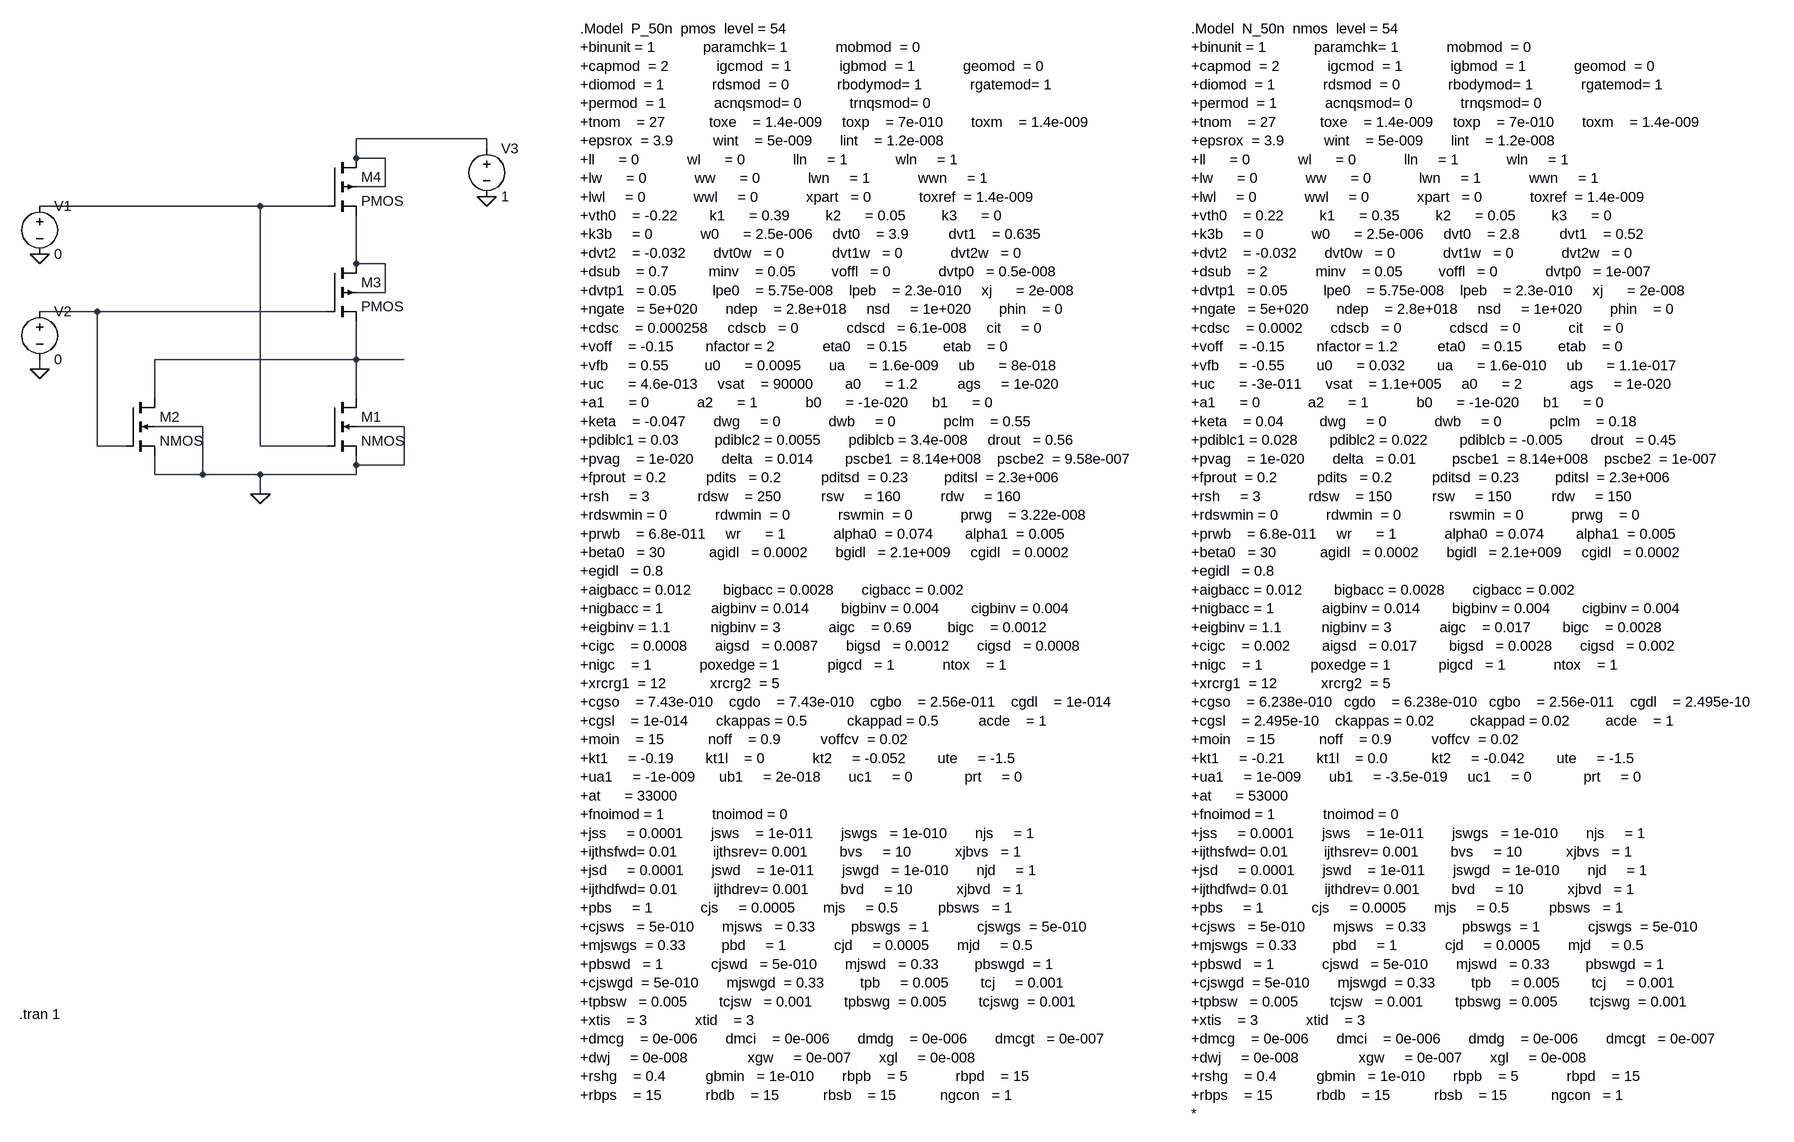
[diagram p0: schematic Draft2.asc]
Draft2.asc, the LTspice schematic file:
Version 4
SHEET 1 3248 1172
WIRE 336 -304 112 -304
WIRE 336 -288 336 -304
WIRE 112 -272 112 -304
WIRE 160 -272 112 -272
WIRE 160 -224 160 -272
WIRE 160 -224 112 -224
WIRE -48 -192 -416 -192
WIRE 64 -192 -48 -192
WIRE 112 -96 112 -176
WIRE 160 -96 112 -96
WIRE 160 -48 160 -96
WIRE 160 -48 112 -48
WIRE -320 -16 -416 -16
WIRE 64 -16 -320 -16
WIRE 112 64 112 0
WIRE 112 64 -224 64
WIRE 192 64 112 64
WIRE -416 80 -416 64
WIRE -224 128 -224 64
WIRE 112 128 112 64
WIRE -144 176 -224 176
WIRE 192 176 112 176
WIRE -320 208 -320 -16
WIRE -272 208 -320 208
WIRE -48 208 -48 -192
WIRE 64 208 -48 208
WIRE 112 240 112 224
WIRE 192 240 192 176
WIRE 192 240 112 240
WIRE -224 256 -224 224
WIRE -144 256 -144 176
WIRE -144 256 -224 256
WIRE -48 256 -144 256
WIRE 112 256 112 240
WIRE 112 256 -48 256
WIRE -48 288 -48 256
FLAG -48 288 0
FLAG -416 -112 0
FLAG -416 80 0
FLAG 336 -208 0
SYMBOL nmos4 64 128 R0
SYMATTR InstName M1
SYMBOL nmos4 -272 128 R0
SYMATTR InstName M2
SYMBOL pmos4 64 -96 R0
SYMATTR InstName M3
SYMBOL pmos4 64 -272 R0
SYMATTR InstName M4
SYMBOL voltage -416 -208 R0
WINDOW 123 0 0 Left 0
WINDOW 39 0 0 Left 0
SYMATTR InstName V1
SYMATTR Value 0
SYMBOL voltage -416 -32 R0
WINDOW 123 0 0 Left 0
WINDOW 39 0 0 Left 0
SYMATTR InstName V2
SYMATTR Value 0
SYMBOL voltage 336 -304 R0
WINDOW 123 0 0 Left 0
WINDOW 39 0 0 Left 0
SYMATTR InstName V3
SYMATTR Value 1
TEXT 968 -488 Left 2 !.Model  P_50n  pmos  level = 54\n+binunit = 1            paramchk= 1            mobmod  = 0          \n+capmod  = 2            igcmod  = 1            igbmod  = 1            geomod  = 0          \n+diomod  = 1            rdsmod  = 0            rbodymod= 1            rgatemod= 1          \n+permod  = 1            acnqsmod= 0            trnqsmod= 0          \n+tnom    = 27           toxe    = 1.4e-009     toxp    = 7e-010       toxm    = 1.4e-009   \n+epsrox  = 3.9          wint    = 5e-009       lint    = 1.2e-008   \n+ll      = 0            wl      = 0            lln     = 1            wln     = 1          \n+lw      = 0            ww      = 0            lwn     = 1            wwn     = 1          \n+lwl     = 0            wwl     = 0            xpart   = 0            toxref  = 1.4e-009   \n+vth0    = -0.22        k1      = 0.39         k2      = 0.05         k3      = 0          \n+k3b     = 0            w0      = 2.5e-006     dvt0    = 3.9          dvt1    = 0.635        \n+dvt2    = -0.032       dvt0w   = 0            dvt1w   = 0            dvt2w   = 0          \n+dsub    = 0.7          minv    = 0.05         voffl   = 0            dvtp0   = 0.5e-008     \n+dvtp1   = 0.05         lpe0    = 5.75e-008    lpeb    = 2.3e-010     xj      = 2e-008     \n+ngate   = 5e+020       ndep    = 2.8e+018     nsd     = 1e+020       phin    = 0          \n+cdsc    = 0.000258     cdscb   = 0            cdscd   = 6.1e-008     cit     = 0          \n+voff    = -0.15        nfactor = 2            eta0    = 0.15         etab    = 0          \n+vfb     = 0.55         u0      = 0.0095       ua      = 1.6e-009     ub      = 8e-018     \n+uc      = 4.6e-013     vsat    = 90000        a0      = 1.2          ags     = 1e-020     \n+a1      = 0            a2      = 1            b0      = -1e-020      b1      = 0          \n+keta    = -0.047       dwg     = 0            dwb     = 0            pclm    = 0.55       \n+pdiblc1 = 0.03         pdiblc2 = 0.0055       pdiblcb = 3.4e-008     drout   = 0.56       \n+pvag    = 1e-020       delta   = 0.014        pscbe1  = 8.14e+008    pscbe2  = 9.58e-007  \n+fprout  = 0.2          pdits   = 0.2          pditsd  = 0.23         pditsl  = 2.3e+006   \n+rsh     = 3            rdsw    = 250          rsw     = 160          rdw     = 160        \n+rdswmin = 0            rdwmin  = 0            rswmin  = 0            prwg    = 3.22e-008  \n+prwb    = 6.8e-011     wr      = 1            alpha0  = 0.074        alpha1  = 0.005      \n+beta0   = 30           agidl   = 0.0002       bgidl   = 2.1e+009     cgidl   = 0.0002     \n+egidl   = 0.8          \n+aigbacc = 0.012        bigbacc = 0.0028       cigbacc = 0.002\n+nigbacc = 1            aigbinv = 0.014        bigbinv = 0.004        cigbinv = 0.004\n+eigbinv = 1.1          nigbinv = 3            aigc    = 0.69         bigc    = 0.0012\n+cigc    = 0.0008       aigsd   = 0.0087       bigsd   = 0.0012       cigsd   = 0.0008\n+nigc    = 1            poxedge = 1            pigcd   = 1            ntox    = 1\n+xrcrg1  = 12           xrcrg2  = 5          \n+cgso    = 7.43e-010    cgdo    = 7.43e-010    cgbo    = 2.56e-011    cgdl    = 1e-014     \n+cgsl    = 1e-014       ckappas = 0.5          ckappad = 0.5          acde    = 1          \n+moin    = 15           noff    = 0.9          voffcv  = 0.02       \n+kt1     = -0.19        kt1l    = 0            kt2     = -0.052        ute     = -1.5\n+ua1     = -1e-009      ub1     = 2e-018       uc1     = 0             prt     = 0\n+at      = 33000\n+fnoimod = 1            tnoimod = 0          \n+jss     = 0.0001       jsws    = 1e-011       jswgs   = 1e-010       njs     = 1          \n+ijthsfwd= 0.01         ijthsrev= 0.001        bvs     = 10           xjbvs   = 1          \n+jsd     = 0.0001       jswd    = 1e-011       jswgd   = 1e-010       njd     = 1          \n+ijthdfwd= 0.01         ijthdrev= 0.001        bvd     = 10           xjbvd   = 1          \n+pbs     = 1            cjs     = 0.0005       mjs     = 0.5          pbsws   = 1          \n+cjsws   = 5e-010       mjsws   = 0.33         pbswgs  = 1            cjswgs  = 5e-010     \n+mjswgs  = 0.33         pbd     = 1            cjd     = 0.0005       mjd     = 0.5        \n+pbswd   = 1            cjswd   = 5e-010       mjswd   = 0.33         pbswgd  = 1          \n+cjswgd  = 5e-010       mjswgd  = 0.33         tpb     = 0.005        tcj     = 0.001      \n+tpbsw   = 0.005        tcjsw   = 0.001        tpbswg  = 0.005        tcjswg  = 0.001      \n+xtis    = 3            xtid    = 3          \n+dmcg    = 0e-006       dmci    = 0e-006       dmdg    = 0e-006       dmcgt   = 0e-007     \n+dwj     = 0e-008               xgw     = 0e-007       xgl     = 0e-008     \n+rshg    = 0.4          gbmin   = 1e-010       rbpb    = 5            rbpd    = 15         \n+rbps    = 15           rbdb    = 15           rbsb    = 15           ngcon   = 1
TEXT 2192 -488 Left 2 !.Model  N_50n  nmos  level = 54\n+binunit = 1            paramchk= 1            mobmod  = 0          \n+capmod  = 2            igcmod  = 1            igbmod  = 1            geomod  = 0          \n+diomod  = 1            rdsmod  = 0            rbodymod= 1            rgatemod= 1          \n+permod  = 1            acnqsmod= 0            trnqsmod= 0          \n+tnom    = 27           toxe    = 1.4e-009     toxp    = 7e-010       toxm    = 1.4e-009   \n+epsrox  = 3.9          wint    = 5e-009       lint    = 1.2e-008   \n+ll      = 0            wl      = 0            lln     = 1            wln     = 1          \n+lw      = 0            ww      = 0            lwn     = 1            wwn     = 1          \n+lwl     = 0            wwl     = 0            xpart   = 0            toxref  = 1.4e-009   \n+vth0    = 0.22         k1      = 0.35         k2      = 0.05         k3      = 0          \n+k3b     = 0            w0      = 2.5e-006     dvt0    = 2.8          dvt1    = 0.52       \n+dvt2    = -0.032       dvt0w   = 0            dvt1w   = 0            dvt2w   = 0          \n+dsub    = 2            minv    = 0.05         voffl   = 0            dvtp0   = 1e-007     \n+dvtp1   = 0.05         lpe0    = 5.75e-008    lpeb    = 2.3e-010     xj      = 2e-008     \n+ngate   = 5e+020       ndep    = 2.8e+018     nsd     = 1e+020       phin    = 0          \n+cdsc    = 0.0002       cdscb   = 0            cdscd   = 0            cit     = 0          \n+voff    = -0.15        nfactor = 1.2          eta0    = 0.15         etab    = 0          \n+vfb     = -0.55        u0      = 0.032        ua      = 1.6e-010     ub      = 1.1e-017   \n+uc      = -3e-011      vsat    = 1.1e+005     a0      = 2            ags     = 1e-020     \n+a1      = 0            a2      = 1            b0      = -1e-020      b1      = 0          \n+keta    = 0.04         dwg     = 0            dwb     = 0            pclm    = 0.18       \n+pdiblc1 = 0.028        pdiblc2 = 0.022        pdiblcb = -0.005       drout   = 0.45       \n+pvag    = 1e-020       delta   = 0.01         pscbe1  = 8.14e+008    pscbe2  = 1e-007     \n+fprout  = 0.2          pdits   = 0.2          pditsd  = 0.23         pditsl  = 2.3e+006   \n+rsh     = 3            rdsw    = 150          rsw     = 150          rdw     = 150        \n+rdswmin = 0            rdwmin  = 0            rswmin  = 0            prwg    = 0          \n+prwb    = 6.8e-011     wr      = 1            alpha0  = 0.074        alpha1  = 0.005      \n+beta0   = 30           agidl   = 0.0002       bgidl   = 2.1e+009     cgidl   = 0.0002     \n+egidl   = 0.8          \n+aigbacc = 0.012        bigbacc = 0.0028       cigbacc = 0.002\n+nigbacc = 1            aigbinv = 0.014        bigbinv = 0.004        cigbinv = 0.004\n+eigbinv = 1.1          nigbinv = 3            aigc    = 0.017        bigc    = 0.0028\n+cigc    = 0.002        aigsd   = 0.017        bigsd   = 0.0028       cigsd   = 0.002\n+nigc    = 1            poxedge = 1            pigcd   = 1            ntox    = 1\n+xrcrg1  = 12           xrcrg2  = 5          \n+cgso    = 6.238e-010   cgdo    = 6.238e-010   cgbo    = 2.56e-011    cgdl    = 2.495e-10     \n+cgsl    = 2.495e-10    ckappas = 0.02         ckappad = 0.02         acde    = 1          \n+moin    = 15           noff    = 0.9          voffcv  = 0.02       \n+kt1     = -0.21        kt1l    = 0.0           kt2     = -0.042        ute     = -1.5\n+ua1     = 1e-009       ub1     = -3.5e-019     uc1     = 0             prt     = 0\n+at      = 53000\n+fnoimod = 1            tnoimod = 0          \n+jss     = 0.0001       jsws    = 1e-011       jswgs   = 1e-010       njs     = 1          \n+ijthsfwd= 0.01         ijthsrev= 0.001        bvs     = 10           xjbvs   = 1          \n+jsd     = 0.0001       jswd    = 1e-011       jswgd   = 1e-010       njd     = 1          \n+ijthdfwd= 0.01         ijthdrev= 0.001        bvd     = 10           xjbvd   = 1          \n+pbs     = 1            cjs     = 0.0005       mjs     = 0.5          pbsws   = 1          \n+cjsws   = 5e-010       mjsws   = 0.33         pbswgs  = 1            cjswgs  = 5e-010     \n+mjswgs  = 0.33         pbd     = 1            cjd     = 0.0005       mjd     = 0.5        \n+pbswd   = 1            cjswd   = 5e-010       mjswd   = 0.33         pbswgd  = 1          \n+cjswgd  = 5e-010       mjswgd  = 0.33         tpb     = 0.005        tcj     = 0.001      \n+tpbsw   = 0.005        tcjsw   = 0.001        tpbswg  = 0.005        tcjswg  = 0.001      \n+xtis    = 3            xtid    = 3          \n+dmcg    = 0e-006       dmci    = 0e-006       dmdg    = 0e-006       dmcgt   = 0e-007     \n+dwj     = 0e-008               xgw     = 0e-007       xgl     = 0e-008     \n+rshg    = 0.4          gbmin   = 1e-010       rbpb    = 5            rbpd    = 15         \n+rbps    = 15           rbdb    = 15           rbsb    = 15           ngcon   = 1\n*
TEXT -450 1156 Left 2 !.tran 1

The netlist it stands for:
* Draft2.asc
M1 N005 N002 0 0 NMOS
M2 N005 N004 0 0 NMOS
M3 N003 N004 N005 N003 PMOS
M4 N001 N002 N003 N001 PMOS
V1 N002 0 0
V2 N004 0 0
V3 N001 0 1
.model NMOS NMOS
.model PMOS PMOS
.lib standard.mos
.Model  P_50n  pmos  level = 54
+binunit = 1            paramchk= 1            mobmod  = 0
+capmod  = 2            igcmod  = 1            igbmod  = 1            geomod  = 0
+diomod  = 1            rdsmod  = 0            rbodymod= 1            rgatemod= 1
+permod  = 1            acnqsmod= 0            trnqsmod= 0
+tnom    = 27           toxe    = 1.4e-009     toxp    = 7e-010       toxm    = 1.4e-009
+epsrox  = 3.9          wint    = 5e-009       lint    = 1.2e-008
+ll      = 0            wl      = 0            lln     = 1            wln     = 1
+lw      = 0            ww      = 0            lwn     = 1            wwn     = 1
+lwl     = 0            wwl     = 0            xpart   = 0            toxref  = 1.4e-009
+vth0    = -0.22        k1      = 0.39         k2      = 0.05         k3      = 0
+k3b     = 0            w0      = 2.5e-006     dvt0    = 3.9          dvt1    = 0.635
+dvt2    = -0.032       dvt0w   = 0            dvt1w   = 0            dvt2w   = 0
+dsub    = 0.7          minv    = 0.05         voffl   = 0            dvtp0   = 0.5e-008
+dvtp1   = 0.05         lpe0    = 5.75e-008    lpeb    = 2.3e-010     xj      = 2e-008
+ngate   = 5e+020       ndep    = 2.8e+018     nsd     = 1e+020       phin    = 0
+cdsc    = 0.000258     cdscb   = 0            cdscd   = 6.1e-008     cit     = 0
+voff    = -0.15        nfactor = 2            eta0    = 0.15         etab    = 0
+vfb     = 0.55         u0      = 0.0095       ua      = 1.6e-009     ub      = 8e-018
+uc      = 4.6e-013     vsat    = 90000        a0      = 1.2          ags     = 1e-020
+a1      = 0            a2      = 1            b0      = -1e-020      b1      = 0
+keta    = -0.047       dwg     = 0            dwb     = 0            pclm    = 0.55
+pdiblc1 = 0.03         pdiblc2 = 0.0055       pdiblcb = 3.4e-008     drout   = 0.56
+pvag    = 1e-020       delta   = 0.014        pscbe1  = 8.14e+008    pscbe2  = 9.58e-007
+fprout  = 0.2          pdits   = 0.2          pditsd  = 0.23         pditsl  = 2.3e+006
+rsh     = 3            rdsw    = 250          rsw     = 160          rdw     = 160
+rdswmin = 0            rdwmin  = 0            rswmin  = 0            prwg    = 3.22e-008
+prwb    = 6.8e-011     wr      = 1            alpha0  = 0.074        alpha1  = 0.005
+beta0   = 30           agidl   = 0.0002       bgidl   = 2.1e+009     cgidl   = 0.0002
+egidl   = 0.8
+aigbacc = 0.012        bigbacc = 0.0028       cigbacc = 0.002
+nigbacc = 1            aigbinv = 0.014        bigbinv = 0.004        cigbinv = 0.004
+eigbinv = 1.1          nigbinv = 3            aigc    = 0.69         bigc    = 0.0012
+cigc    = 0.0008       aigsd   = 0.0087       bigsd   = 0.0012       cigsd   = 0.0008
+nigc    = 1            poxedge = 1            pigcd   = 1            ntox    = 1
+xrcrg1  = 12           xrcrg2  = 5
+cgso    = 7.43e-010    cgdo    = 7.43e-010    cgbo    = 2.56e-011    cgdl    = 1e-014
+cgsl    = 1e-014       ckappas = 0.5          ckappad = 0.5          acde    = 1
+moin    = 15           noff    = 0.9          voffcv  = 0.02
+kt1     = -0.19        kt1l    = 0            kt2     = -0.052        ute     = -1.5
+ua1     = -1e-009      ub1     = 2e-018       uc1     = 0             prt     = 0
+at      = 33000
+fnoimod = 1            tnoimod = 0
+jss     = 0.0001       jsws    = 1e-011       jswgs   = 1e-010       njs     = 1
+ijthsfwd= 0.01         ijthsrev= 0.001        bvs     = 10           xjbvs   = 1
+jsd     = 0.0001       jswd    = 1e-011       jswgd   = 1e-010       njd     = 1
+ijthdfwd= 0.01         ijthdrev= 0.001        bvd     = 10           xjbvd   = 1
+pbs     = 1            cjs     = 0.0005       mjs     = 0.5          pbsws   = 1
+cjsws   = 5e-010       mjsws   = 0.33         pbswgs  = 1            cjswgs  = 5e-010
+mjswgs  = 0.33         pbd     = 1            cjd     = 0.0005       mjd     = 0.5
+pbswd   = 1            cjswd   = 5e-010       mjswd   = 0.33         pbswgd  = 1
+cjswgd  = 5e-010       mjswgd  = 0.33         tpb     = 0.005        tcj     = 0.001
+tpbsw   = 0.005        tcjsw   = 0.001        tpbswg  = 0.005        tcjswg  = 0.001
+xtis    = 3            xtid    = 3
+dmcg    = 0e-006       dmci    = 0e-006       dmdg    = 0e-006       dmcgt   = 0e-007
+dwj     = 0e-008               xgw     = 0e-007       xgl     = 0e-008
+rshg    = 0.4          gbmin   = 1e-010       rbpb    = 5            rbpd    = 15
+rbps    = 15           rbdb    = 15           rbsb    = 15           ngcon   = 1
.Model  N_50n  nmos  level = 54
+binunit = 1            paramchk= 1            mobmod  = 0
+capmod  = 2            igcmod  = 1            igbmod  = 1            geomod  = 0
+diomod  = 1            rdsmod  = 0            rbodymod= 1            rgatemod= 1
+permod  = 1            acnqsmod= 0            trnqsmod= 0
+tnom    = 27           toxe    = 1.4e-009     toxp    = 7e-010       toxm    = 1.4e-009
+epsrox  = 3.9          wint    = 5e-009       lint    = 1.2e-008
+ll      = 0            wl      = 0            lln     = 1            wln     = 1
+lw      = 0            ww      = 0            lwn     = 1            wwn     = 1
+lwl     = 0            wwl     = 0            xpart   = 0            toxref  = 1.4e-009
+vth0    = 0.22         k1      = 0.35         k2      = 0.05         k3      = 0
+k3b     = 0            w0      = 2.5e-006     dvt0    = 2.8          dvt1    = 0.52
+dvt2    = -0.032       dvt0w   = 0            dvt1w   = 0            dvt2w   = 0
+dsub    = 2            minv    = 0.05         voffl   = 0            dvtp0   = 1e-007
+dvtp1   = 0.05         lpe0    = 5.75e-008    lpeb    = 2.3e-010     xj      = 2e-008
+ngate   = 5e+020       ndep    = 2.8e+018     nsd     = 1e+020       phin    = 0
+cdsc    = 0.0002       cdscb   = 0            cdscd   = 0            cit     = 0
+voff    = -0.15        nfactor = 1.2          eta0    = 0.15         etab    = 0
+vfb     = -0.55        u0      = 0.032        ua      = 1.6e-010     ub      = 1.1e-017
+uc      = -3e-011      vsat    = 1.1e+005     a0      = 2            ags     = 1e-020
+a1      = 0            a2      = 1            b0      = -1e-020      b1      = 0
+keta    = 0.04         dwg     = 0            dwb     = 0            pclm    = 0.18
+pdiblc1 = 0.028        pdiblc2 = 0.022        pdiblcb = -0.005       drout   = 0.45
+pvag    = 1e-020       delta   = 0.01         pscbe1  = 8.14e+008    pscbe2  = 1e-007
+fprout  = 0.2          pdits   = 0.2          pditsd  = 0.23         pditsl  = 2.3e+006
+rsh     = 3            rdsw    = 150          rsw     = 150          rdw     = 150
+rdswmin = 0            rdwmin  = 0            rswmin  = 0            prwg    = 0
+prwb    = 6.8e-011     wr      = 1            alpha0  = 0.074        alpha1  = 0.005
+beta0   = 30           agidl   = 0.0002       bgidl   = 2.1e+009     cgidl   = 0.0002
+egidl   = 0.8
+aigbacc = 0.012        bigbacc = 0.0028       cigbacc = 0.002
+nigbacc = 1            aigbinv = 0.014        bigbinv = 0.004        cigbinv = 0.004
+eigbinv = 1.1          nigbinv = 3            aigc    = 0.017        bigc    = 0.0028
+cigc    = 0.002        aigsd   = 0.017        bigsd   = 0.0028       cigsd   = 0.002
+nigc    = 1            poxedge = 1            pigcd   = 1            ntox    = 1
+xrcrg1  = 12           xrcrg2  = 5
+cgso    = 6.238e-010   cgdo    = 6.238e-010   cgbo    = 2.56e-011    cgdl    = 2.495e-10
+cgsl    = 2.495e-10    ckappas = 0.02         ckappad = 0.02         acde    = 1
+moin    = 15           noff    = 0.9          voffcv  = 0.02
+kt1     = -0.21        kt1l    = 0.0           kt2     = -0.042        ute     = -1.5
+ua1     = 1e-009       ub1     = -3.5e-019     uc1     = 0             prt     = 0
+at      = 53000
+fnoimod = 1            tnoimod = 0
+jss     = 0.0001       jsws    = 1e-011       jswgs   = 1e-010       njs     = 1
+ijthsfwd= 0.01         ijthsrev= 0.001        bvs     = 10           xjbvs   = 1
+jsd     = 0.0001       jswd    = 1e-011       jswgd   = 1e-010       njd     = 1
+ijthdfwd= 0.01         ijthdrev= 0.001        bvd     = 10           xjbvd   = 1
+pbs     = 1            cjs     = 0.0005       mjs     = 0.5          pbsws   = 1
+cjsws   = 5e-010       mjsws   = 0.33         pbswgs  = 1            cjswgs  = 5e-010
+mjswgs  = 0.33         pbd     = 1            cjd     = 0.0005       mjd     = 0.5
+pbswd   = 1            cjswd   = 5e-010       mjswd   = 0.33         pbswgd  = 1
+cjswgd  = 5e-010       mjswgd  = 0.33         tpb     = 0.005        tcj     = 0.001
+tpbsw   = 0.005        tcjsw   = 0.001        tpbswg  = 0.005        tcjswg  = 0.001
+xtis    = 3            xtid    = 3
+dmcg    = 0e-006       dmci    = 0e-006       dmdg    = 0e-006       dmcgt   = 0e-007
+dwj     = 0e-008               xgw     = 0e-007       xgl     = 0e-008
+rshg    = 0.4          gbmin   = 1e-010       rbpb    = 5            rbpd    = 15
+rbps    = 15           rbdb    = 15           rbsb    = 15           ngcon   = 1
*
.tran 1
.backanno
.end